# EAGLE schematic adb (EAGLE 7.0.0)
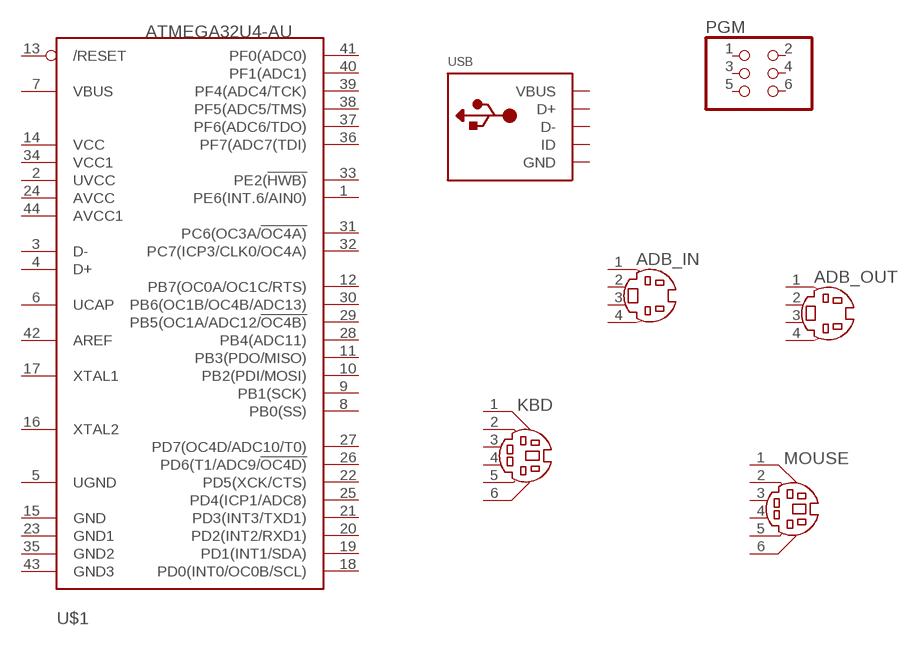
[diagram p0: schematic, sheet 1]

## Parts
ADB_IN  MDIN04K  [MDIN04K]
ADB_OUT  MDIN04K  [MDIN04K]
KBD  MDIN06K  [MDIN06K]
MOUSE  MDIN06K  [MDIN06K]
PGM  PINHD-2X3  [2X03]
U$1  ATMEGA32U4-AU  [TQFP44]
USB  USBMINIB  [USB-MINIB]
Unconnected: ADB_IN.1 ADB_IN.2 ADB_IN.3 ADB_IN.4 ADB_OUT.1 ADB_OUT.2 ADB_OUT.3 ADB_OUT.4 KBD.1 KBD.2 KBD.3 KBD.4 KBD.5 KBD.6 MOUSE.1 MOUSE.2 MOUSE.3 MOUSE.4 MOUSE.5 MOUSE.6 PGM.1 PGM.2 PGM.3 PGM.4 PGM.5 PGM.6 U$1.1(PE6(INT.6/AIN0)) U$1.2(UVCC) U$1.3(D-) U$1.4(D+) U$1.5(UGND) U$1.6(UCAP) U$1.7(VBUS) U$1.8(PB0(SS)) U$1.9(PB1(SCK)) U$1.10(PB2(PDI/MOSI)) U$1.11(PB3(PDO/MISO)) U$1.12(PB7(OC0A/OC1C/RTS)) U$1.13(/RESET) U$1.14(VCC) U$1.15(GND) U$1.16(XTAL2) U$1.17(XTAL1) U$1.18(PD0(INT0/OC0B/SCL)) U$1.19(PD1(INT1/SDA)) U$1.20(PD2(INT2/RXD1)) U$1.21(PD3(INT3/TXD1)) U$1.22(PD5(XCK/CTS)) U$1.23(GND1) U$1.24(AVCC) U$1.25(PD4(ICP1/ADC8)) U$1.26(PD6(T1/ADC9/!OC4D)) U$1.27(PD7(OC4D/ADC10/T0)) U$1.28(PB4(ADC11)) U$1.29(PB5(OC1A/ADC12/!OC4B)) U$1.30(PB6(OC1B/OC4B/ADC13)) U$1.31(PC6(OC3A/!OC4A)) U$1.32(PC7(ICP3/CLK0/OC4A)) U$1.33(PE2(!HWB)) U$1.34(VCC1) U$1.35(GND2) U$1.36(PF7(ADC7(TDI)) U$1.37(PF6(ADC6/TDO)) U$1.38(PF5(ADC5/TMS)) U$1.39(PF4(ADC4/TCK)) U$1.40(PF1(ADC1)) U$1.41(PF0(ADC0)) U$1.42(AREF) U$1.43(GND3) U$1.44(AVCC1) USB.D+ USB.D- USB.ID

## Power pins joined to a net without a drawn wire
GND: USB.GND
VBUS: USB.VBUS

## Library data of the parts
ADB_IN ADB_OUT = con-yamaichi:MDIN04K: YAMAICHI CONNECTOR; OC_FARNELL: unknown; OC_NEWARK: unknown
KBD MOUSE = con-yamaichi:MDIN06K: YAMAICHI CONNECTOR; OC_FARNELL: unknown; OC_NEWARK: unknown
PGM = pinhead:PINHD-2X3: PIN HEADER
U$1 = adafruit:ATMEGA32U4: http://www.ladyada.net/library/eagle
USB = adafruit:USB: USB Connectors USBMINIB - Surface Mount Female Mini-B USB Connector 4UConnector: 06564 By microbuilder.eu Thru-hole RA Female Mini-B USB Connector 4UConnector: 18732 By ladyada.net